# Altium project S01-17676.PrjPCB
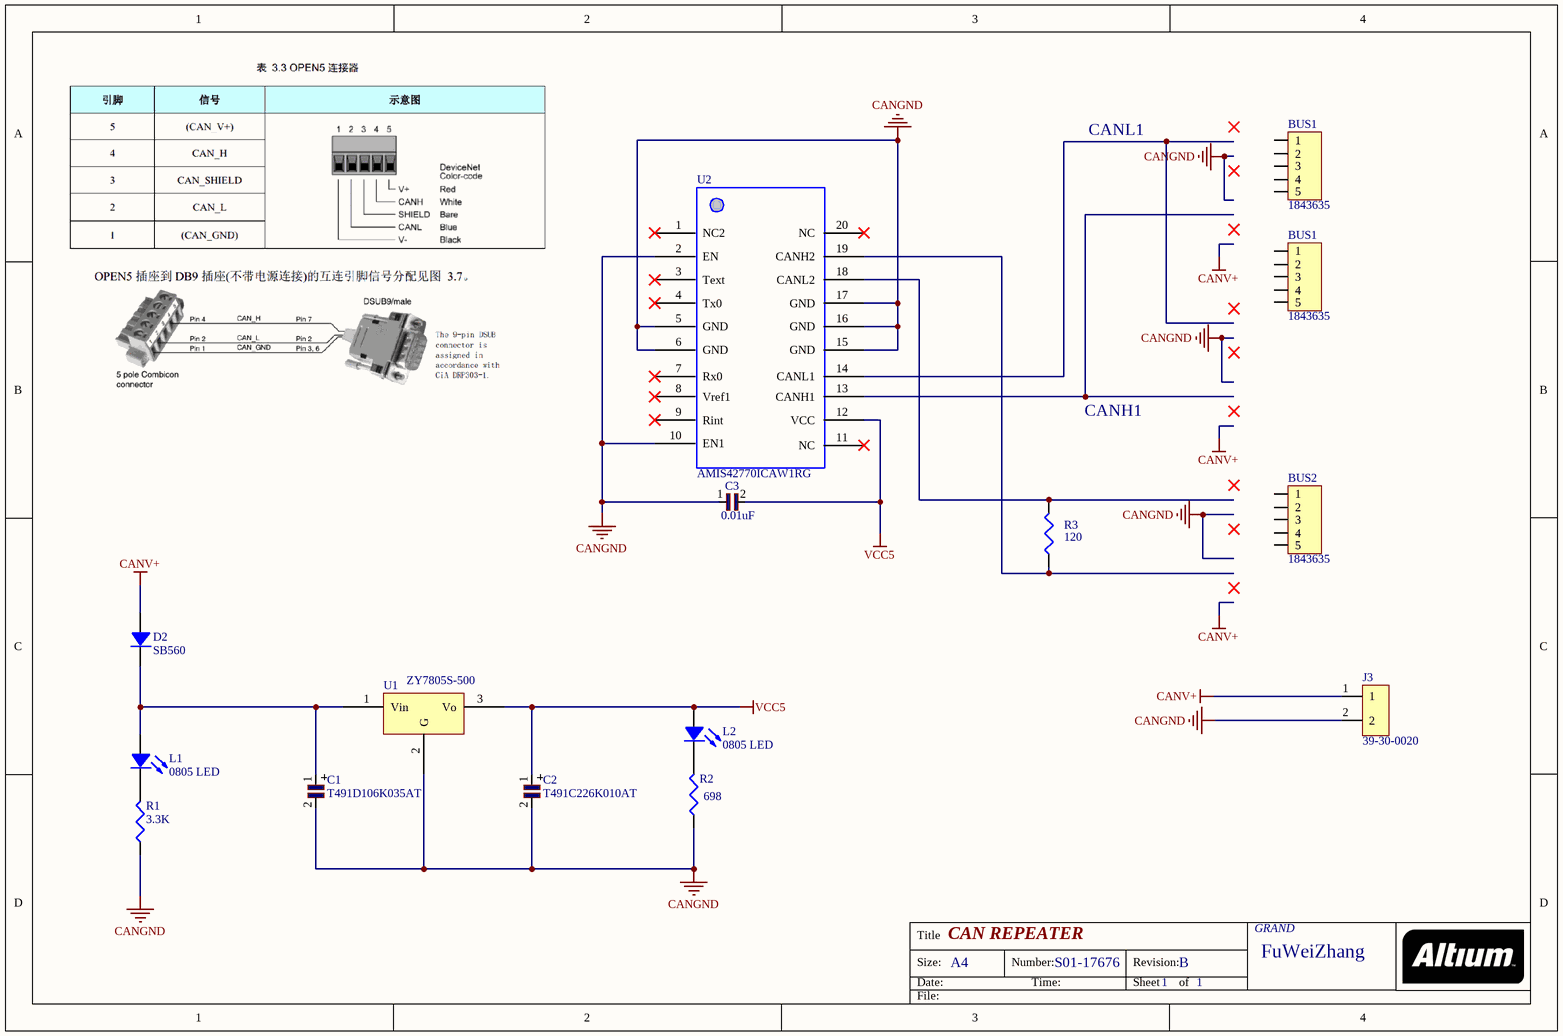
[diagram p0: S01-17676.SchDoc]
1 sheet, 15 parts. Net scope: global (net labels, ports and power ports of the same name join across sheets).
Board file: S01-17676 PCBA.PcbDoc

## Sheet S01-17676.SchDoc: CAN REPEATER
size A4; Date: 2018/04/11; DrawnBy: FuWeiZhang; Engineer: FuWeiZhang; Organization: GRAND; DocumentNumber: S01-17676; Revision: B; SheetNumber: 1; SheetTotal: 1

### Parts
(Parts that share a designator on the sheet are numbered #1, #2 ... from top to bottom, then left to right.)
BUS1#1  1843635  [1843635]
BUS1#2  1843635  [1843635]
BUS2  1843635  [1843635]
C1  T491D106K035AT  [T491D106K035AT]
C2  T491C226K010AT  [T491C226K010AT]
C3  0.01uF  [0805 Capacitor]
D2  SB560  [SB560]
J3  39-30-0020  [39-30-0020]
L1  0805 LED  [0805 LED]
L2  0805 LED  [0805 LED]
R1  3.3K  [0805 Resistor]
R2  698  [0805 Resistor]
R3  120  [0805 Resistor]
U1  ZY7805S-500  [ZY78xxS-500]
U2  AMIS42770ICAW1RG  [AMIS42770ICAW1RG]

### Nets
CANGND: C1.2 C2.2 C3.1 J3.2 R1.1 R2.1 U1.2(G) U2.2(EN) U2.5(GND) U2.6(GND) U2.10(EN1) U2.15(GND) U2.16(GND) U2.17(GND)
CANV+: D2.1 J3.1
VCC5: C2.1 C3.2 L2.1(A) U1.3(Vo) U2.12(VCC)
NetC1_1: C1.1 D2.2 L1.1(A) U1.1(Vin)
NetL1_2: L1.2(K) R1.2
NetL2_2: L2.2(K) R2.2
NetR3_1: R3.1 U2.19(CANH2)
NetR3_2: R3.2 U2.18(CANL2)

Not connected (* = marked no-connect by the designer): BUS1#1 1 2 3 4 5; BUS1#2 1 2 3 4 5; BUS2 1 2 3 4 5; U2 1(NC2)* 3(Text)* 4(Tx0)* 7(Rx0)* 8(Vref1)* 9(Rint)* 11(NC)* 13(CANH1) 14(CANL1) 20(NC)*

### Notes on the sheet
- CANL1
- CANH1
- FuWeiZhang
- Title
- Size:
- Date:
- A4
- Number:
- Time:
- Revision:
- Sheet
- of
- File:

### Library data of the parts
BUS1#1 BUS1#2 BUS2 = 1843635: 端子块, 针座, 3.5 mm, 5 路, 8 A, 160 V, 通孔竖直
C1 = T491D106K035AT: 表面贴装钽电容, 10 μF, 35 V, T491 系列, ± 10%, 2917 [7343 公制]
C2 = T491C226K010AT: 表面贴装钽电容, 22 μF, 10 V, T491 系列, ± 10%, 2312 [6032 公
C3 = 0805 Capacitor
D2 = SB560: 肖特基二极管与整流器 5a/60V
J3 = 39-30-0020: 线至板连接器, 4.2 mm, 2 触点, 针座, Mini-Fit Jr. 5569系列, 通孔安装
R1-R3 = 0805 Resistor
U1 = ZY78xxS-500
U2 = AMIS42770ICAW1RG: CAN REPEATER